# Altium schematic sheet LG_TRACKER_DO.SchDoc
size A4; SheetNumber: 16; SheetTotal: 16
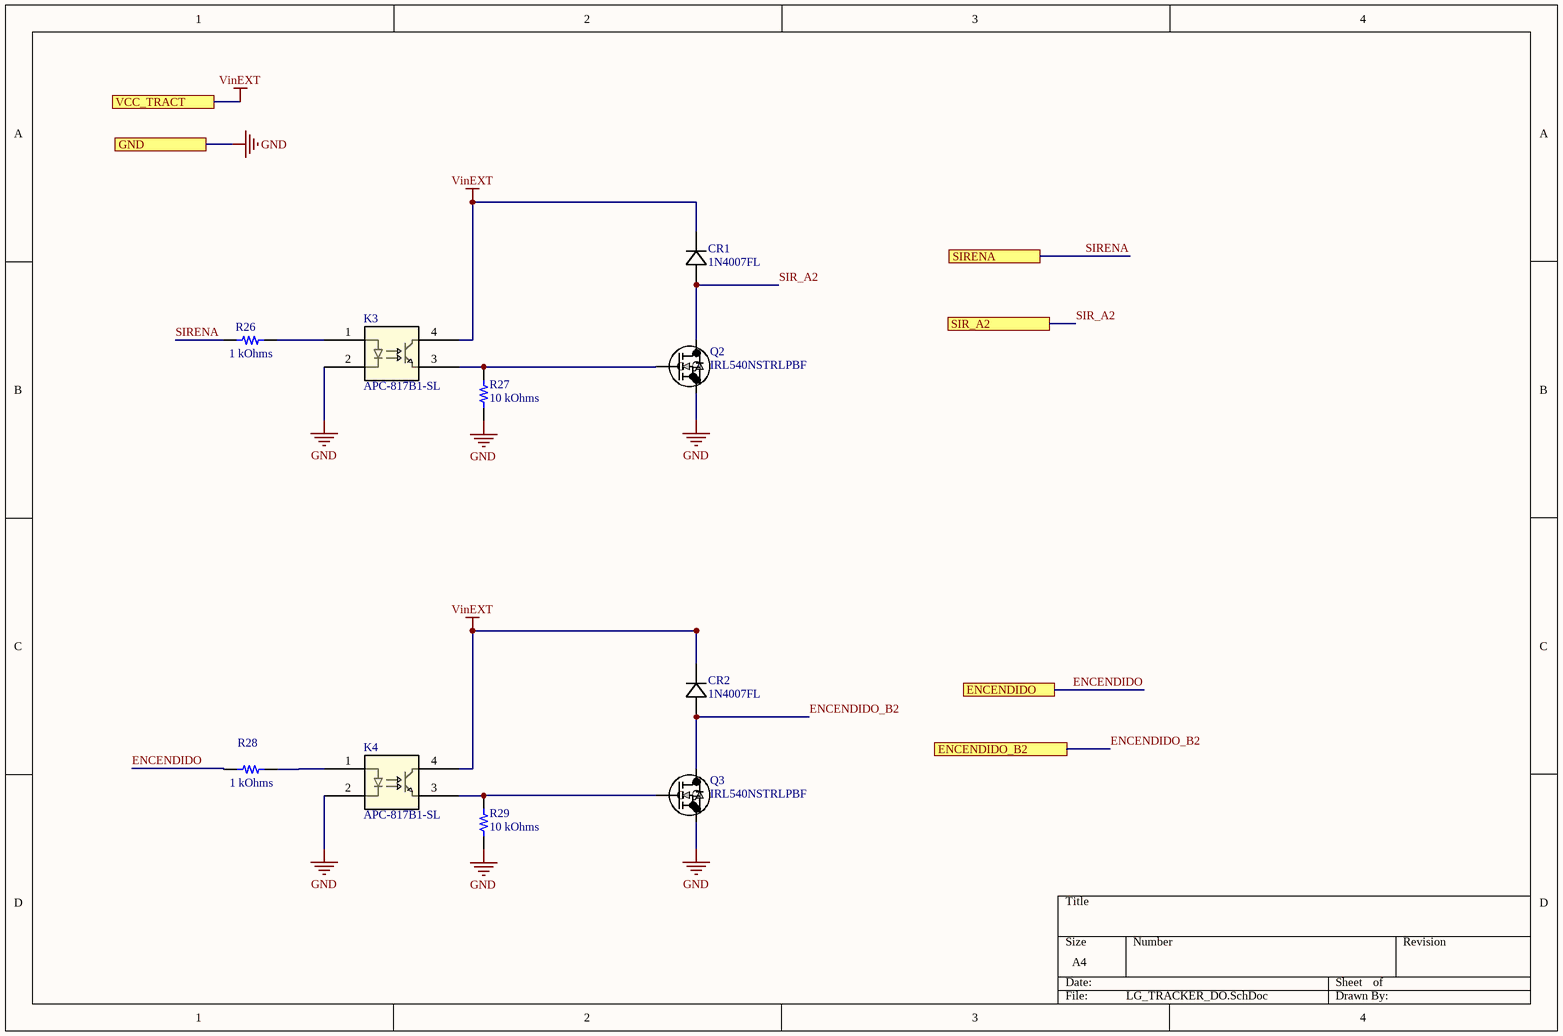
[diagram p0: LG_TRACKER_DO.SchDoc]

## Parts
CR1  1N4007FL  [CR_SOD-123FL_SME]
CR2  1N4007FL  [CR_SOD-123FL_SME]
K3  APC-817B1-SL  [APC-817xx-SL_AMB]
K4  APC-817B1-SL  [APC-817xx-SL_AMB]
Q2  IRL540NSTRLPBF  [NMOSGSD_D2PAK_IRL540NSTRLPBF_INF]
Q3  IRL540NSTRLPBF  [NMOSGSD_D2PAK_IRL540NSTRLPBF_INF]
R26  1 kOhms  [RES 0402_1005]
R27  10 kOhms  [RES 0603_1608]
R28  1 kOhms  [RES 0402_1005]
R29  10 kOhms  [RES 0603_1608]

## Ports
ENCENDIDO, ENCENDIDO_B2, GND, SIR_A2, SIRENA, VCC_TRACT

## Nets
GND: K3.2 K4.2 Q2.2(S) Q3.2(S) R27.1 R29.1 ; port GND
VinEXT: CR1.1(CATHODE) CR2.1(CATHODE) K3.4 K4.4 ; port VCC_TRACT
ENCENDIDO: R28.1 ; port ENCENDIDO
ENCENDIDO_B2: CR2.2(ANODE) Q3.3(D) ; port ENCENDIDO_B2
SIR_A2: CR1.2(ANODE) Q2.3(D) ; port SIR_A2
SIRENA: R26.1 ; port SIRENA
NetK3_1: K3.1 R26.2
NetK3_3: K3.3 Q2.1(G) R27.2
NetK4_1: K4.1 R28.2
NetK4_3: K4.3 Q3.1(G) R29.2

## Library data of the parts
CR1 CR2 = 1N4007FL: Description; Manufacturer_Name: SMC Diode Solutions; Copyright: Copyright (C) 2025 Ultra Librarian. All rights reserved.; Manufacturer_Part_Number: 1N4007FL
K3 K4 = APC-817B1-SL: Description; Manufacturer_Name: American Bright; Type: Optoisolators; Copyright: Copyright (C) 2025 Ultra Librarian. All rights reserved.; Manufacturer_Part_Number: APC-817B1-SL; RefDes: RefDes
Q2 Q3 = IRL540NSTRLPBF: Description; Manufacturer_Name: Infineon; Copyright: Copyright (C) 2025 Ultra Librarian. All rights reserved.; Manufacturer_Part_Number: IRL540NSTRLPBF
R26 R28 = AT0402BRD071KL: RES SMD 1K OHM 0.1% 1/16W 0402; Manufacturer: Yageo; Power (Watts): 0.063W, 1/16W; Temperature Coefficient: ±25ppm/°C; Part Number: AT0402BRD071KL; Value: 1 kOhms; ComponentLink1Description: Datasheet; ComponentLink1URL: http://www.yageo.com/documents/recent/PYu-AT_51_RoHS_L_5.pdf; ComponentLink2Description: DigiKey Link; ComponentLink2URL: https://www.digikey.com/en/products/detail/yageo/AT0402BRD071KL/5138607; Composition: Thin Film; Device Package: 0402 (1005 Metric); Features: Anti-Sulfur, Automotive AEC-Q200, Moisture Resistant; Height - Seated (Max): 0.014" (0.35mm); LastUpdated: 31/8/2025 15:04:18; Lifecycle Status: Active; Minimum Order: 1; Number of Terminations: 2; Operating Temperature: -55°C ~ 155°C; Package / Case: 0402 (1005 Metric); Packaging: TapeAndReel; PartId: 2462; Part Status: Active; Price: 0.09; Ratings: AEC-Q200; Resistance: 1 kOhms; Series: AT; Size / Dimension: 0.039" L x 0.020" W (1.00mm x 0.50mm); Supplier 1: DigiKey; Supplier Part Number 1: YAG2088CT-ND; Supplier Device Package: 0402; Tolerance: ±0.1%
R27 R29 = RC0603FR-0710KL: RES 10K OHM 1% 1/10W 0603; Manufacturer: Yageo; Power (Watts): 0.1W, 1/10W; Temperature Coefficient: ±100ppm/°C; Part Number: RC0603FR-0710KL; Value: 10 kOhms; ComponentLink1Description: Datasheet; ComponentLink1URL: https://www.yageo.com/upload/media/product/productsearch/datasheet/rchip/PYu-RC_Group_51_RoHS_L_10.pdf; ComponentLink2Description: DigiKey Link; ComponentLink2URL: https://www.digikey.com/en/products/detail/yageo/RC0603FR-0710KL/726880; Composition: Thick Film; Device Package: 0603 (1608 Metric); Features: Moisture Resistant; Height - Seated (Max): 0.022" (0.55mm); LastUpdated: 10/30/2023 7:36:43 PM; Lifecycle Status: Active; Minimum Order: 1; Number of Terminations: 2; Operating Temperature: -55°C ~ 155°C; Package / Case: 0603 (1608 Metric); Packaging: CutTape; PartId: 22599; Part Status: Active; Price: 0.01; Resistance: 10 kOhms; Series: RC_L; Size / Dimension: 0.063" L x 0.031" W (1.60mm x 0.80mm); Supplier 1: DigiKey; Supplier Part Number 1: 311-10.0KHRCT-ND; Supplier Device Package: 0603; Tolerance: ±1%